# EAGLE schematic OPEnS-Power-1.0.0 (EAGLE 9.2.0)
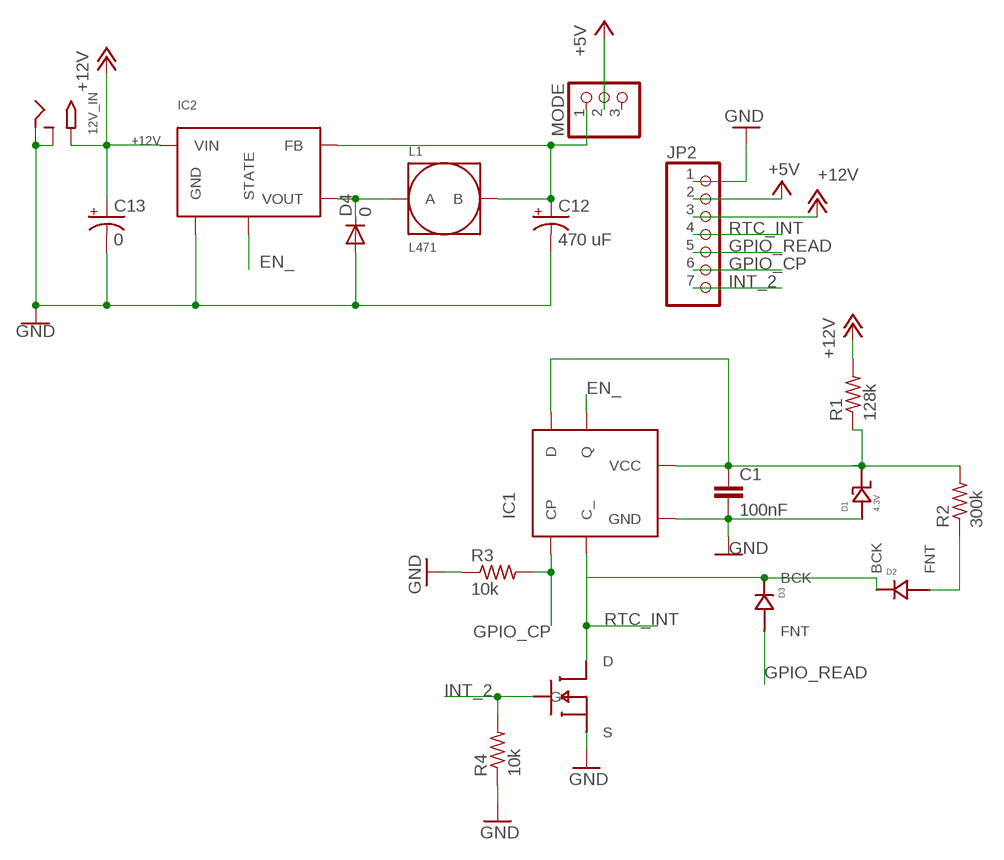
[diagram p0: schematic, sheet 1]

## Parts
12V_IN  2.1MMJACKSMT  [DCJACK_2MM_SMT]
C1  100nF  C  [C0805]
C12  470 uF  CPOL-US153CLV-0810  [153CLV-0810]
C13  0  CPOL-US153CLV-0505  [153CLV-0505]
D1  4.3V  ZENER-DO219  [DO-219AC]
D2  DIODE-DO-214AC  [DIODE-DO-214AC]
D3  DIODE-DO-214AC  [DIODE-DO-214AC]
D4  0  1N4004  [DO41-10]
IC1  NC7SZ175  [SC70]
IC2  LM2575  [TO-263]
JP2  PINHD-1X7  [1X07]
L1  L471  [12-12]
MODE  PINHD-1X3  [1X03]
Q1  MOSFET-SOT23F  [SOT-23F]
R1  128k  R-US_R0805  [R0805]
R2  300k  R-US_R0805  [R0805]
R3  10k  R-US_R0805  [R0805]
R4  10k  R-US_R0805  [R0805]

## Nets
5_RAW [5v]: C12.+ IC2.FB L1.B MODE.1
+5V [5v]: JP2.2 MODE.2
+12V: 12V_IN.PWR2(TIP) C13.+ IC2.VIN JP2.3 R1.2
EN_ [sig]: IC1.Q IC2.STATE
GND: 12V_IN.GND(RING) 12V_IN.GNDBREAK(RING_SW) C1.2 C12.- C13.- D1.BCK D4.A IC1.GND IC2.GND JP2.1 Q1.S R3.1 R4.1
GPIO_CP [sig]: IC1.CP JP2.6 R3.2
GPIO_READ [sig]: D3.FNT JP2.5
INT_2: JP2.7 Q1.G R4.2
N$1 [5v]: D4.C IC2.VOUT L1.A
N$2 [sig]: C1.1 D1.FNT IC1.D IC1.VCC R1.1 R2.2
N$4: D2.FNT R2.1
RTC_INT [sig]: D2.BCK D3.BCK IC1.C_ JP2.4 Q1.D
Unconnected: MODE.3

## Library data of the parts
12V_IN = adafruit:2.1MMJACK: 2.1mm x 5.5mm THM DC jack with internal switch. Digikey part #PJ-102A, 4UCON part #05537 2.1mm x 5.5mm SMT DC jack with internal switch. Digikey part #PJ-002A-SMT, 4UCON part #03267 By microbuilder.eu & adafruit.com
C1 = eagle-ltspice:C: CAPACITOR, European symbol; SPICEMODEL: NONE; SPICEPREFIX: C
C12 = rcl:CPOL-US: POLARIZED CAPACITOR, American symbol; SPICEPREFIX: C
C13 = adafruit:CPOL-US: POLARIZED CAPACITOR, American symbol
D1 = beach:ZENER-DO219
D2 D3 = beach:DIODE-DO-214AC: Diode - DO-214AC, SMA
D4 = adafruit:1N4004: DIODE General purpose 1N400x type rectifier (With bigger pads) http://www.ladyada.net/library/pcb/eaglelibrary.html
IC1 = beach:NC7SZ175
IC2 = LM2575:LM2575
JP2 = pinhead:PINHD-1X7: PIN HEADER
L1 = LM2575:L471
MODE = pinhead:PINHD-1X3: PIN HEADER
Q1 = beach:MOSFET-SOT23F
R1-R4 = resistor:R-US_: RESISTOR, American symbol

## Net classes
1 12v: width 0.457 mm, clearance 0.305 mm
2 5v: width 0.406 mm, clearance 0.305 mm
3 sig: width 0.152 mm, clearance 0.152 mm